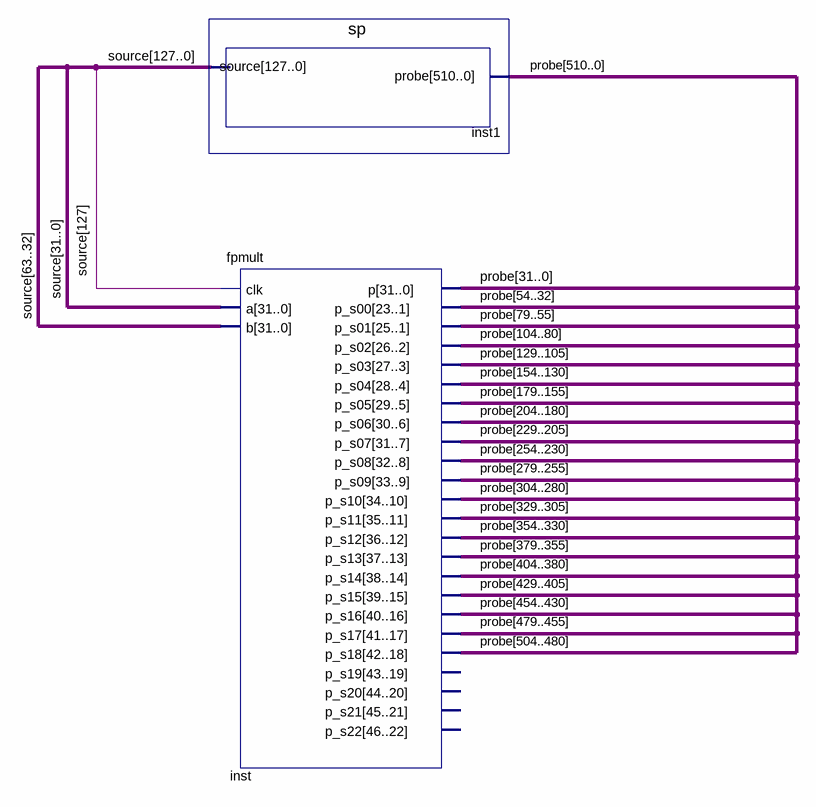
[diagram p0: schematic sheet]
// Quartus schematic fpmult_top.bdf as structural Verilog: 2 symbols, 0 pins
module fpmult_top (
);

  wire [127:0] source;
  wire [510:0] probe;

  sp inst1 (.probe(probe), .source(source));
  fpmult inst (
    .clk(source[127]), .a(source[31:0]), .b(source[63:32]), .p(probe[31:0]), .p_s00(probe[54:32]),
    .p_s01(probe[79:55]), .p_s02(probe[104:80]), .p_s03(probe[129:105]), .p_s04(probe[154:130]),
    .p_s05(probe[179:155]), .p_s06(probe[204:180]), .p_s07(probe[229:205]), .p_s08(probe[254:230]),
    .p_s09(probe[279:255]), .p_s10(probe[304:280]), .p_s11(probe[329:305]), .p_s12(probe[354:330]),
    .p_s13(probe[379:355]), .p_s14(probe[404:380]), .p_s15(probe[429:405]), .p_s16(probe[454:430]),
    .p_s17(probe[479:455]), .p_s18(probe[504:480]));  // open: p_s19, p_s20, p_s21, p_s22
endmodule
